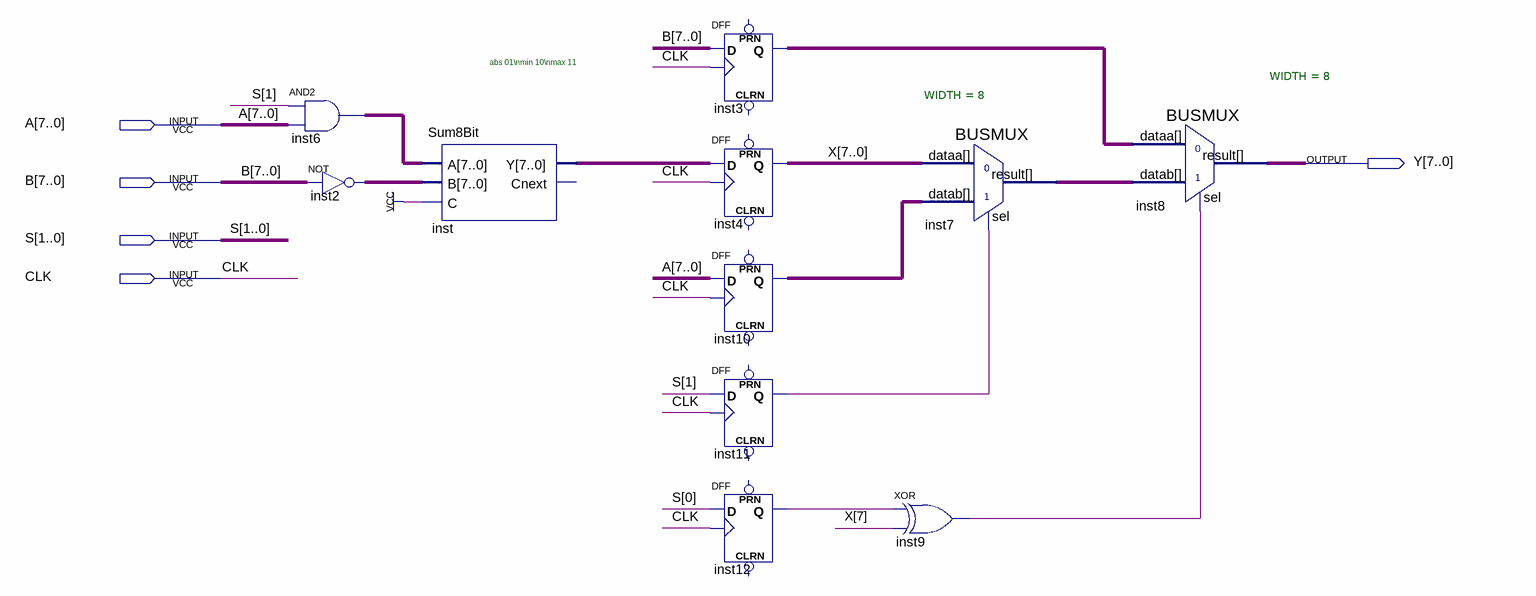
[diagram p0: schematic sheet]
// Quartus schematic AU1.bdf as structural Verilog: 11 symbols, 5 pins
module AU1 (
  input  [7:0] A,
  input  [7:0] B,
  input  [1:0] S,
  input  CLK,
  output [7:0] Y
);

  wire inst9_out, inst11_q, inst12_q;
  wire [7:0] inst2_out, inst3_q, inst6_out, inst7_result, inst10_q, inst_y, X;

  assign inst6_out = {8{S[1]}} & A;  // AND2 inst6, 8 bits wide
  assign inst2_out = ~B;  // NOT inst2, 8 bits wide
  Sum8Bit inst (.A(inst6_out), .B(inst2_out), .C(1'b1), .Y(inst_y));  // open: Cnext
  DFF inst3[7:0] (.CLK(CLK), .D(B), .Q(inst3_q));  // open: CLRN, PRN
  DFF inst4[7:0] (.CLK(CLK), .D(inst_y), .Q(X));  // open: CLRN, PRN
  DFF inst10[7:0] (.CLK(CLK), .D(A), .Q(inst10_q));  // open: CLRN, PRN
  DFF inst11 (.CLK(CLK), .D(S[1]), .Q(inst11_q));  // open: CLRN, PRN
  DFF inst12 (.CLK(CLK), .D(S[0]), .Q(inst12_q));  // open: CLRN, PRN
  xor inst9 (inst9_out, inst12_q, X[7]);
  BUSMUX #(.WIDTH(8)) inst7 (.datab(inst10_q), .sel(inst11_q), .dataa(X), .result(inst7_result));
  BUSMUX #(.WIDTH(8)) inst8 (.datab(inst7_result), .sel(inst9_out), .dataa(inst3_q), .result(Y));

  // Notes on the sheet:
  //   abs 01\nmin 10\nmax 11
endmodule
